# EAGLE design nes1 (EAGLE 7.7.0)
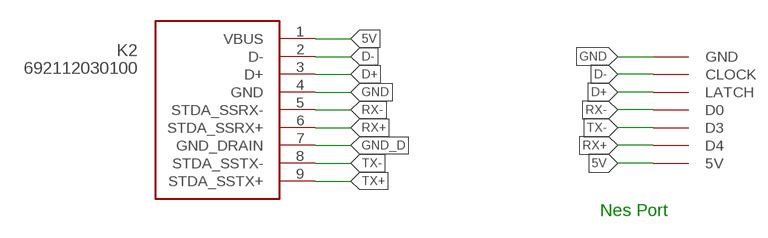
[diagram p0: schematic, sheet 1]

## Parts
K2  692112030100  [692112030100]
U$1  NESCONNNO_TABS  [NESCONN_NO_TABS]

## Nets
5V: K2.1(VBUS) U$1.5V
D+: K2.3(D+) U$1.LATCH
D-: K2.2(D-) U$1.CLOCK
GND: K2.4(GND) U$1.GND
GND_D: K2.7(GND_DRAIN)
RX+: K2.6(STDA_SSRX+) U$1.D4
RX-: K2.5(STDA_SSRX-) U$1.D0
TX+: K2.9(STDA_SSTX+)
TX-: K2.8(STDA_SSTX-) U$1.D3

## Notes on the sheet
- Nes Port

## Library data of the parts
K2 = Wuerth_Elektronik_eiCan_Communication_Connectors_STENCIL:692112030100: WR-COM USB 3.0 SMT PLUG WITH CLIPTYPE A
U$1 = gamepad-conn:NESCONN

## Board
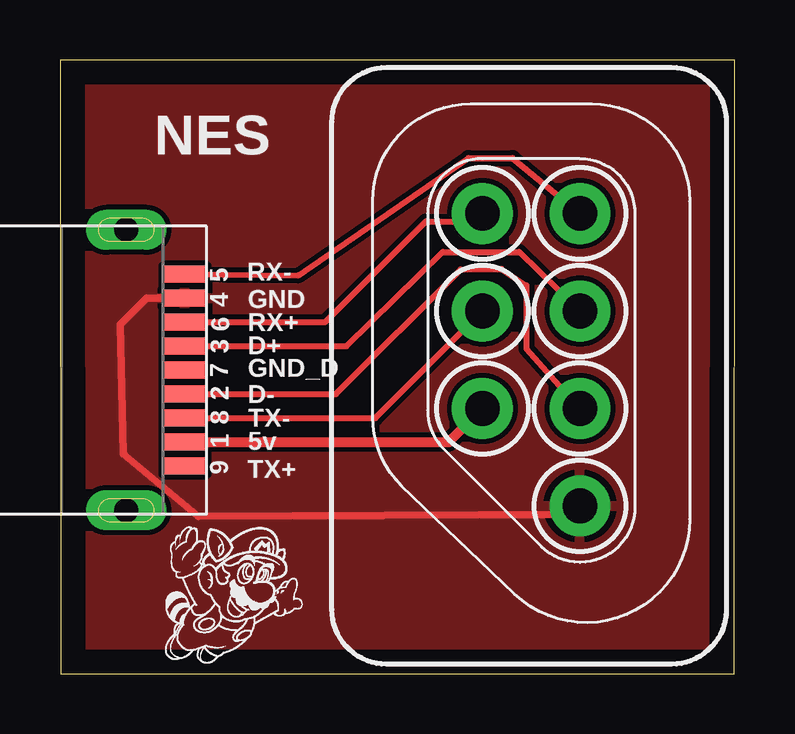
[diagram p1: board, top side]
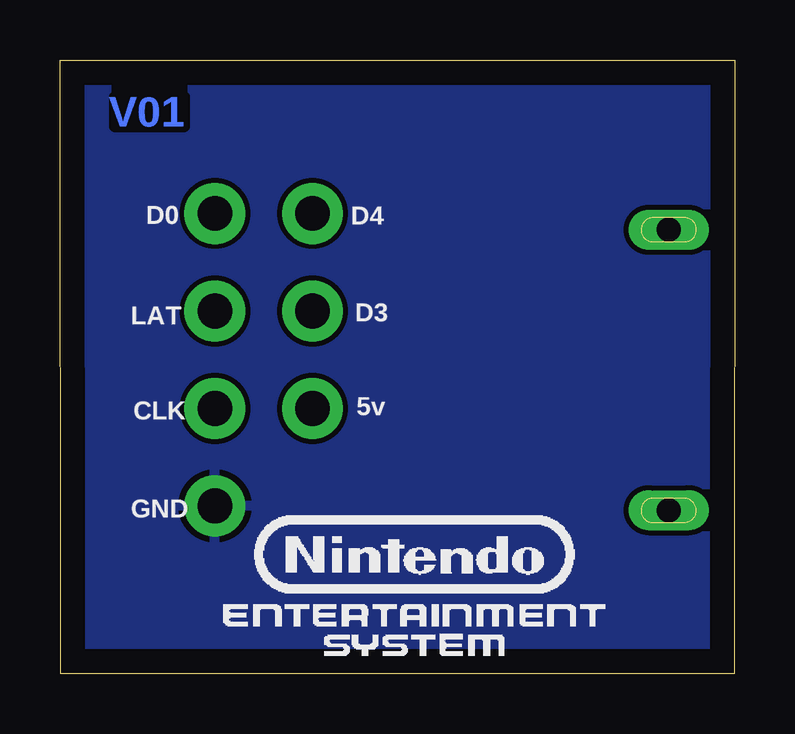
[diagram p2: board, bottom side, seen from below]

Size 28.12 x 25.6 mm. Coordinates in mm from the lower left corner, seen from the top.
Outline: 0.03,0 28.1,0 28.12,25.6 0,25.6 0.03,0
Copper layers (1*16): Top 0.035mm / dielectric 1.5mm / Bottom 0.035mm
Design rules "default": minimum track width 10mil, minimum drill 24mil, track to track 8mil, track to pad 8mil, pad to pad 8mil, via to via 8mil, smd to smd 8mil, copper to edge 40mil, drill to drill 8mil, minimum pad ring 10mil, minimum via ring 8mil, stop-mask expansion 4mil, vias tented up to drill 0mil, thermal gap 10mil

### Footprints (pad centres in the part's own frame; a part is rotated, then mirrored left to right if it is on the bottom)
692112030100 = smd 0.7 x 1.8: 1 -3,0; 2 -1,0; 3 1,0; 4 3,0; 5 4,0; 6 2,0; 7 0,0; 8 -2,0; 9 -4,0 | drill 1 pad 1.676 long: Z1 5.85,2.45; Z2 -5.85,2.45
NESCONN_NO_TABS = drill 1.448 pad 2.54: 5V 8.128,0; CLOCK 8.128,4.064; D0 0,4.064; D3 4.064,0; D4 0,0; GND 12.192,4.064; LATCH 4.064,4.064

### Placement (x,y rotation side)
K2  5.21,12.67 90 top
U$1  17.6,19.2 270 top

### Tracks (layer width: path | path; a pad name or v marks a point on that pad's centre or on a via)
5V
  Top 0.406: K2.1 16.2,9.67 U$1.5V
D+
  Top 0.254: K2.3 11.95,13.67 15.95,17.6 19.13,17.6 U$1.LATCH
D-
  Top 0.254: K2.2 11.5,11.67 16.69,16.87 18.39,16.89 19.43,16.21 19.43,13.56 U$1.CLOCK
GND
  Top 0.305: K2.4 3.61,15.67 2.51,14.58 2.64,9.17 5.77,6.58 21.31,6.65 U$1.GND
  pour Bottom: 0.13,25.37 27.89,25.4 27.94,0.15 0.13,-0.03
  pour Top: 0.33,25.45 27.89,25.37 27.97,0.13 0.08,0
RX+
  Top 0.254: K2.6 11.04,14.67 15.24,18.87 17.27,18.87 U$1.D4
RX-
  Top 0.254: K2.5 9.92,16.62 17.02,21.51 18.85,21.51 U$1.D0
TX-
  Top 0.254: K2.8 13.14,10.67 U$1.D3

### Text on the board
Bottom: V01
tPlace: NES | 5 | RX- | 4 | GND | 6 | RX+ | 3 | D+ | 7 | GND_D | 2 | D- | 8 | TX- | 1 | 5v | 9 | TX+
bPlace: D4 | D0 | D3 | LAT | 5v | CLK | GND